# EAGLE design RGB-Controler (EAGLE 9.1.1)
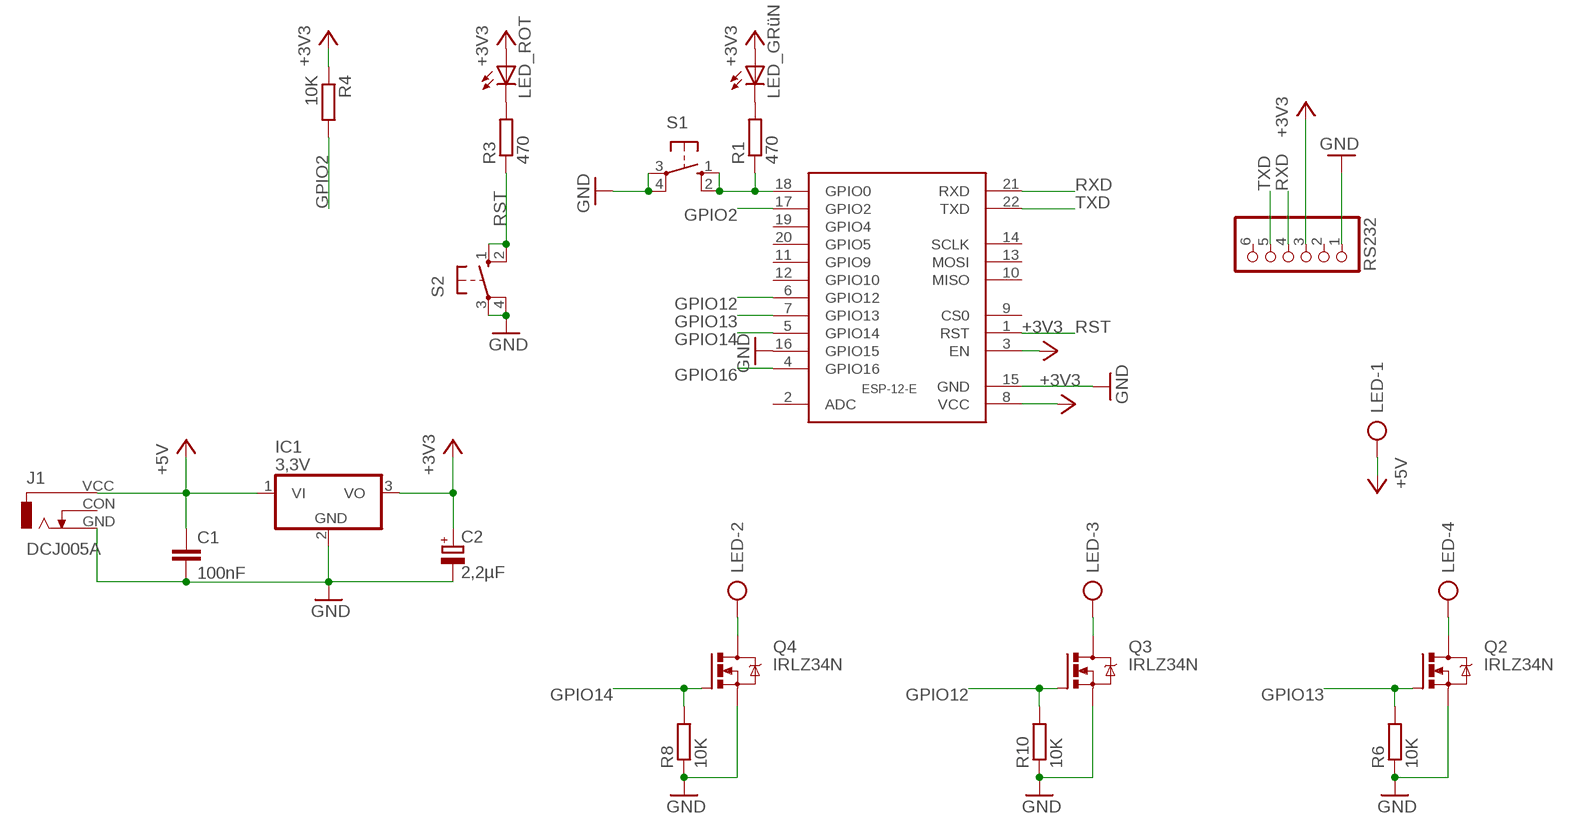
[diagram p0: schematic, sheet 1]

## Parts
C1  100nF  C-EU050-030X075  [C050-030X075]
C2  2,2µF  CPOL-EUE2.5-6  [E2,5-6]
IC1  3,3V  7805TV  [TO220V]
J1  DCJ005A  [DC005A]
LED  AK300/4  [AK300/4]
LED_GRüN  LED5MM  [LED5MM]
LED_ROT  LED5MM  [LED5MM]
Q2  IRLZ34N  IRF540  [TO220BV]
Q3  IRLZ34N  IRF540  [TO220BV]
Q4  IRLZ34N  IRF540  [TO220BV]
R1  470  R-EU_0207/10  [0207/10]
R3  470  R-EU_0207/10  [0207/10]
R4  10K  R-EU_0207/10  [0207/10]
R6  10K  R-EU_0207/10  [0207/10]
R8  10K  R-EU_0207/10  [0207/10]
R10  10K  R-EU_0207/10  [0207/10]
RS232  PINHD-1X6  [1X06]
S1  10-XX  [B3F-10XX]
S2  10-XX  [B3F-10XX]
U$1  ESP-12-E  [ESP-12-E]

## Nets
+3V3: C2.+ IC1.3(VO) LED_GRüN.A LED_ROT.A R4.1 RS232.3 U$1.3(EN) U$1.8(VCC)
+5V: C1.1 IC1.1(VI) J1.VCC LED.1
GND: C1.2 C2.- IC1.2(GND) J1.GND Q2.S Q3.S Q4.S R6.1 R8.1 R10.1 RS232.1 S1.3(P) S1.4(P1) S2.3(P) S2.4(P1) U$1.15(GND) U$1.16(GPIO15)
GPIO2: R4.2 U$1.17(GPIO2)
GPIO12: Q3.G R10.2 U$1.6(GPIO12)
GPIO13: Q2.G R6.2 U$1.7(GPIO13)
GPIO14: Q4.G R8.2 U$1.5(GPIO14)
GPIO16: U$1.4(GPIO16)
N$1: R1.1 S1.1(S) S1.2(S1) U$1.18(GPIO0)
N$2: LED.2 Q4.D
N$3: LED_GRüN.K(C) R1.2
N$4: LED_ROT.K(C) R3.2
N$5: LED.3 Q3.D
N$13: LED.4 Q2.D
RST: R3.1 S2.1(S) S2.2(S1) U$1.1(RST)
RXD: RS232.4 U$1.21(RXD)
TXD: RS232.5 U$1.22(TXD)
Unconnected: J1.CON RS232.2 RS232.6 U$1.2(ADC) U$1.9(CS0) U$1.10(MISO) U$1.11(GPIO9) U$1.12(GPIO10) U$1.13(MOSI) U$1.14(SCLK) U$1.19(GPIO4) U$1.20(GPIO5)

## Library data of the parts
C1 = rcl:C-EU: CAPACITOR, European symbol
C2 = rcl:CPOL-EU: POLARIZED CAPACITOR, European symbol
IC1 = linear:78*: Positive VOLTAGE REGULATOR Source: http://cache.national.com/ds/LM/LM78L05.pdf http://www.fairchildsemi.com/ds/LM/LM7805.pdf
J1 = !Häufige Bauteile:DCJ005A: DC POWER JACK Source: DCJ0202.pdf; OC_FARNELL: unknown; OC_NEWARK: unknown
LED = con-ptr500:AK300/4: CONNECTOR; OC_FARNELL: unknown; OC_NEWARK: unknown
LED_GRüN LED_ROT = !Häufige Bauteile:LED5MM
Q2-Q4 = transistor-power:IRF540: HEXFET Power MOSFET
R1 R3 R4 R6 R8 R10 = rcl:R-EU_: RESISTOR, European symbol
RS232 = pinhead:PINHD-1X6: PIN HEADER
S1 S2 = switch-omron:10-XX: OMRON SWITCH; MPN: B3F-1000; OC_FARNELL: 176432; OC_NEWARK: 36M3542
U$1 = !Eigene Library SMD:ESP-12-E

## Board
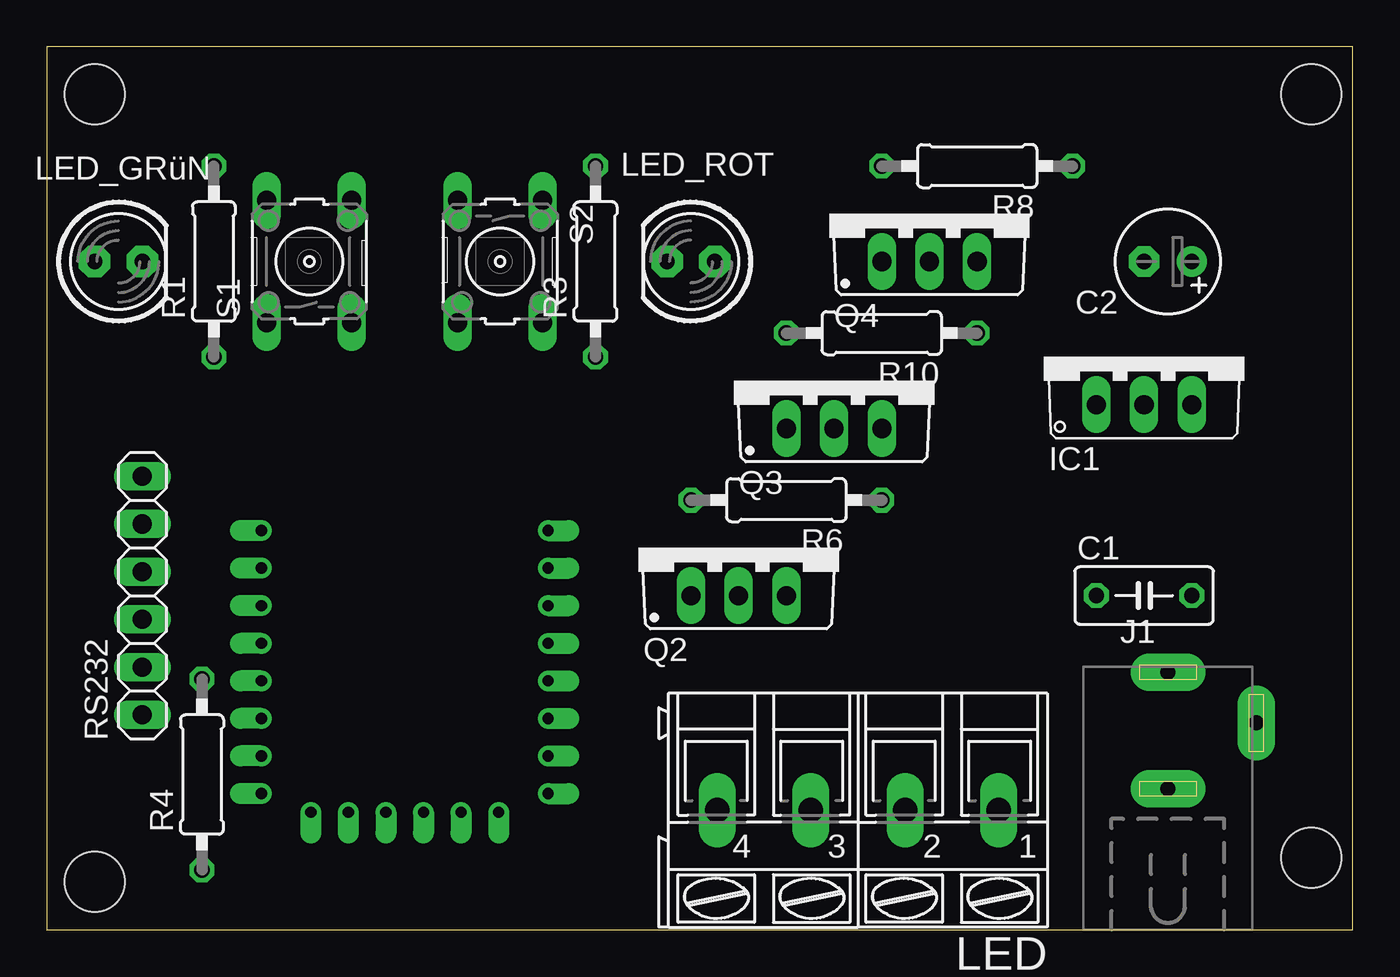
[diagram p1: board, top side]
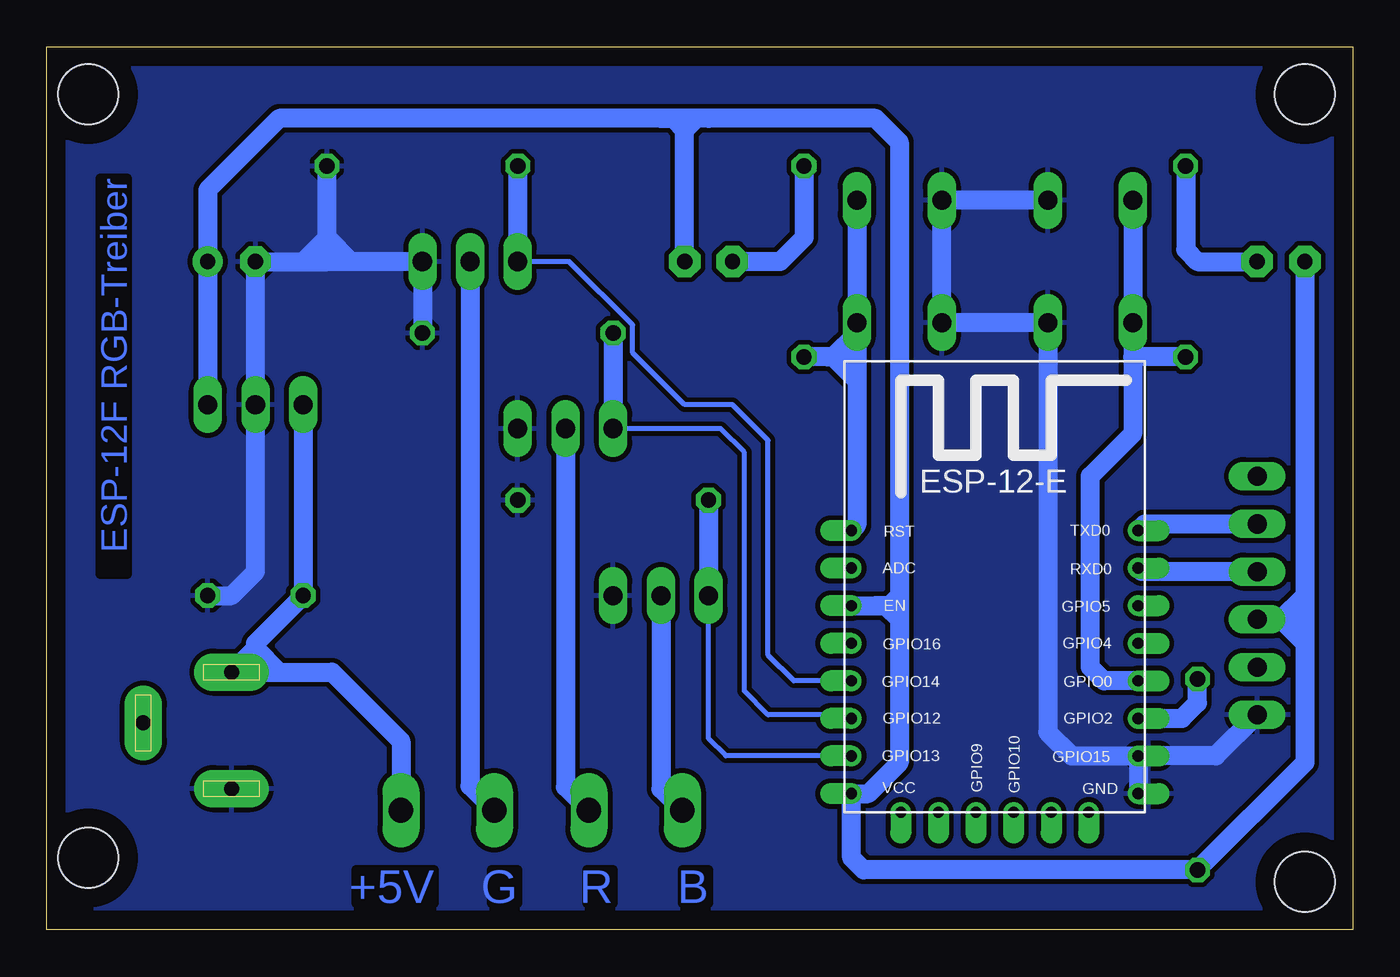
[diagram p2: board, bottom side, seen from below]

Size 69.52 x 46.98 mm. Coordinates in mm from the lower left corner, seen from the top.
Outline: 0,0 69.52,0 69.52,46.98 0,46.98 0,0
Copper layers (1*16): Top 0.035mm / dielectric 1.5mm / Bottom 0.035mm
Design rules "platinenbelichter": minimum track width 10mil, minimum drill 24mil, track to track 10mil, track to pad 10mil, pad to pad 10mil, via to via 10mil, smd to smd 10mil, copper to edge 40mil, drill to drill 8mil, minimum pad ring 10mil, minimum via ring 8mil, stop-mask expansion 10mil, vias tented up to drill 0mil, thermal gap 10mil
Holes 3.2 mm at 2.54,44.45 67.31,44.45 67.31,3.81 2.54,2.54

### Footprints (pad centres in the part's own frame; a part is rotated, then mirrored left to right if it is on the bottom)
C050-030X075 = drill 0.813 octagon: 1 -2.54,0; 2 2.54,0
E2,5-6 = drill 0.813 pad 1.6: + -1.27,0 | drill 0.813 pad 1.6 octagon: - 1.27,0
TO220V = drill 1.016 long: 1 -2.54,-2.54; 2 0,-2.54; 3 2.54,-2.54
DC005A = drill 0.8 pad 2 long: CON 4.7,4.65; GND 0,1.15; VCC 0,7.35
AK300/4 = drill 1.321 long: 1 -7.493,0; 2 -2.515,0; 3 2.515,0; 4 7.493,0
LED5MM = drill 0.813 pad 1.676 octagon: A -1.27,0; K 1.27,0
TO220BV = drill 1.016 long: D 0,-2.54; G -2.54,-2.54; S 2.54,-2.54
0207/10 = drill 0.813 octagon: 1 -5.08,0; 2 5.08,0
1X06 = drill 1.016 long: 1 -6.35,0; 2 -3.81,0; 3 -1.27,0; 4 1.27,0; 5 3.81,0; 6 6.35,0
B3F-10XX = drill 1.016 long: 1 -3.251,2.261; 2 3.251,2.261; 3 -3.251,-2.261; 4 3.251,-2.261
ESP-12-E = drill 0.6 offset: 1 -7.635,6; 2 -7.635,4; 3 -7.635,2; 4 -7.635,0; 5 -7.635,-2; 6 -7.635,-4; 7 -7.635,-6; 8 -7.635,-8; 9 -5,-9; 10 -3,-9; 11 -1,-9; 12 1,-9; 13 3,-9; 14 5,-9; 15 7.635,-8; 16 7.635,-6; 17 7.635,-4; 18 7.635,-2; 19 7.635,0; 20 7.635,2; 21 7.635,4; 22 7.635,6

### Placement (x,y rotation side)
C1  58.42,17.78 0 top
C2  59.69,35.56 180 top
IC1  58.42,30.48 0 top
J1  59.69,6.35 0 top
LED  43.18,6.35 180 top
LED_GRüN  3.81,35.56 0 top
LED_ROT  34.29,35.56 180 top
Q2  36.83,20.32 0 top
Q3  41.91,29.21 0 top
Q4  46.99,38.1 0 top
R1  8.89,35.56 90 top
R3  29.21,35.56 90 top
R4  8.25,8.26 90 top
R6  39.37,22.86 180 top
R8  49.53,40.64 180 top
R10  44.45,31.75 180 top
RS232  5.08,17.78 90 top
S1  13.97,35.56 90 top
S2  24.13,35.56 270 top
U$1  19.05,15.24 0 bottom

### Tracks (layer width: path | path; a pad name or v marks a point on that pad's centre or on a via)
+3V3
  Bottom 1.016: 25.4,17.24 U$1.3 25.4,17.24 | 25.4,17.24 24.13,17.24 | 24.13,17.24 24.13,16.51 | 24.13,16.51 24.13,8.89 25.78,7.24 U$1.8 26.67,7.22 26.67,3.81 26.04,3.17 R4.1 2.54,8.89 2.54,15.24 | LED_ROT.A 35.56,42.55 | IC1.3 C2.+ 60.96,39.37 57.15,43.18 36.83,43.18 | 25.4,17.24 24.86,17.24 24.13,16.51 | 24.13,17.78 24.13,41.91 25.4,43.18 34.29,43.18 | 24.13,17.78 24.13,17.24 | 34.29,43.18 36.83,43.18 | 36.83,43.18 | 36.83,43.18 36.2,43.18 35.56,42.55 | 34.29,43.18 34.93,43.18 35.56,42.55 | LED_GRüN.A 2.54,21.59 2.54,20.32 2.54,19.05 2.54,17.78 | 2.54,17.78 2.54,16.51 | 2.54,16.51 2.54,15.24 | RS232.3 2.54,16.51 | RS232.3 3.81,16.51 | 3.81,16.51 2.54,15.24 | RS232.3 3.81,16.51 | 3.81,16.51 2.54,17.78 | 24.13,17.78 24.67,17.24 25.4,17.24
+5V
  Bottom 1.016: IC1.1 C1.1 58.42,15.24 | 58.42,13.7 J1.VCC 58.42,14.97 | 58.42,13.7 57.15,13.7 | 57.15,13.7 54.34,13.7 50.67,10.03 LED.1 | 58.42,15.24 58.42,13.7 | 58.42,14.97 58.42,15.24 | 57.15,13.7 58.42,14.97 | 58.42,14.97 58.42,15.24
GND
  Bottom 1.016: S1.4 S2.3 S2.4 S1.3 16.23,10.52 14.96,9.24 U$1.16 | U$1.16 U$1.15 | R10.1 Q4.S 53.34,35.56 | 53.34,35.56 54.61,35.56 | 54.61,35.56 54.61,36.83 | 54.61,36.83 R8.1 | 55.88,35.56 C2.- IC1.2 58.42,19.05 59.69,17.78 C1.2 | 55.88,35.56 54.61,35.56 | U$1.16 7.27,9.24 RS232.1 | J1.GND 59.81,7.62 | 55.88,35.56 54.61,36.83 | 54.61,36.83 53.34,35.56
  pour Bottom: 0,46.99 69.85,46.99 69.85,0 0,0
GPIO2
  Bottom 1.016: U$1.17 9.08,11.24 8.25,12.06 R4.2
GPIO12
  Bottom 0.254: U$1.6 26.88,11.43 31.12,11.43 32.38,12.7 32.38,25.4 33.66,26.67 Q3.G
  Bottom 1.016: R10.2 Q3.G
GPIO13
  Bottom 0.254: U$1.7 33.37,9.24 34.29,10.16 Q2.G
  Bottom 1.016: R6.2 Q2.G
GPIO14
  Bottom 0.254: U$1.5 29.75,13.24 31.12,14.61 31.12,26.04 33.02,27.94 35.56,27.94 38.33,30.71 38.33,32.18 41.71,35.56 Q4.G
  Bottom 1.016: R8.2 Q4.G
N$1
  Bottom 1.016: S1.2 S1.1 11.71,30.48 | U$1.18 13.24,13.24 13.97,13.97 13.97,24.13 11.71,26.39 11.71,30.48 | R1.1 11.71,30.48
N$2
  Bottom 1.016: Q4.D 46.99,7.64 LED.2
N$3
  Bottom 1.016: LED_GRüN.K 8.25,35.56 8.89,36.2 R1.2
N$4
  Bottom 1.016: R3.2 29.21,36.83 30.48,35.56 LED_ROT.K
N$5
  Bottom 1.016: Q3.D 41.91,7.59 LED.3
N$13
  Bottom 1.016: LED.4 36.83,7.49 Q2.D
RST
  Bottom 1.016: S2.1 S2.2 26.39,31.75 | 26.39,31.75 26.39,30.48 | 26.39,30.48 26.39,29.21 | 26.39,29.21 26.39,21.53 U$1.1 | 26.39,30.48 27.94,30.48 | 27.94,30.48 R3.1 | 27.94,30.48 27.66,30.48 | 27.66,30.48 26.39,31.75 | 27.66,30.48 26.39,29.21
RXD
  Bottom 1.016: RS232.4 11.23,19.05 U$1.21
TXD
  Bottom 1.016: U$1.22 11.07,21.59 RS232.5

### Text on the board
Bottom: ESP-12F RGB-Treiber | B | R | G | +5V